# EasyEDA schematic Sheet_2.json
TITLE: Sheet_2; REV: 1.0; Date: 2025-07-21; Sheet: 1/1; Drawn By: hunarbatra1414; Company: Your Company
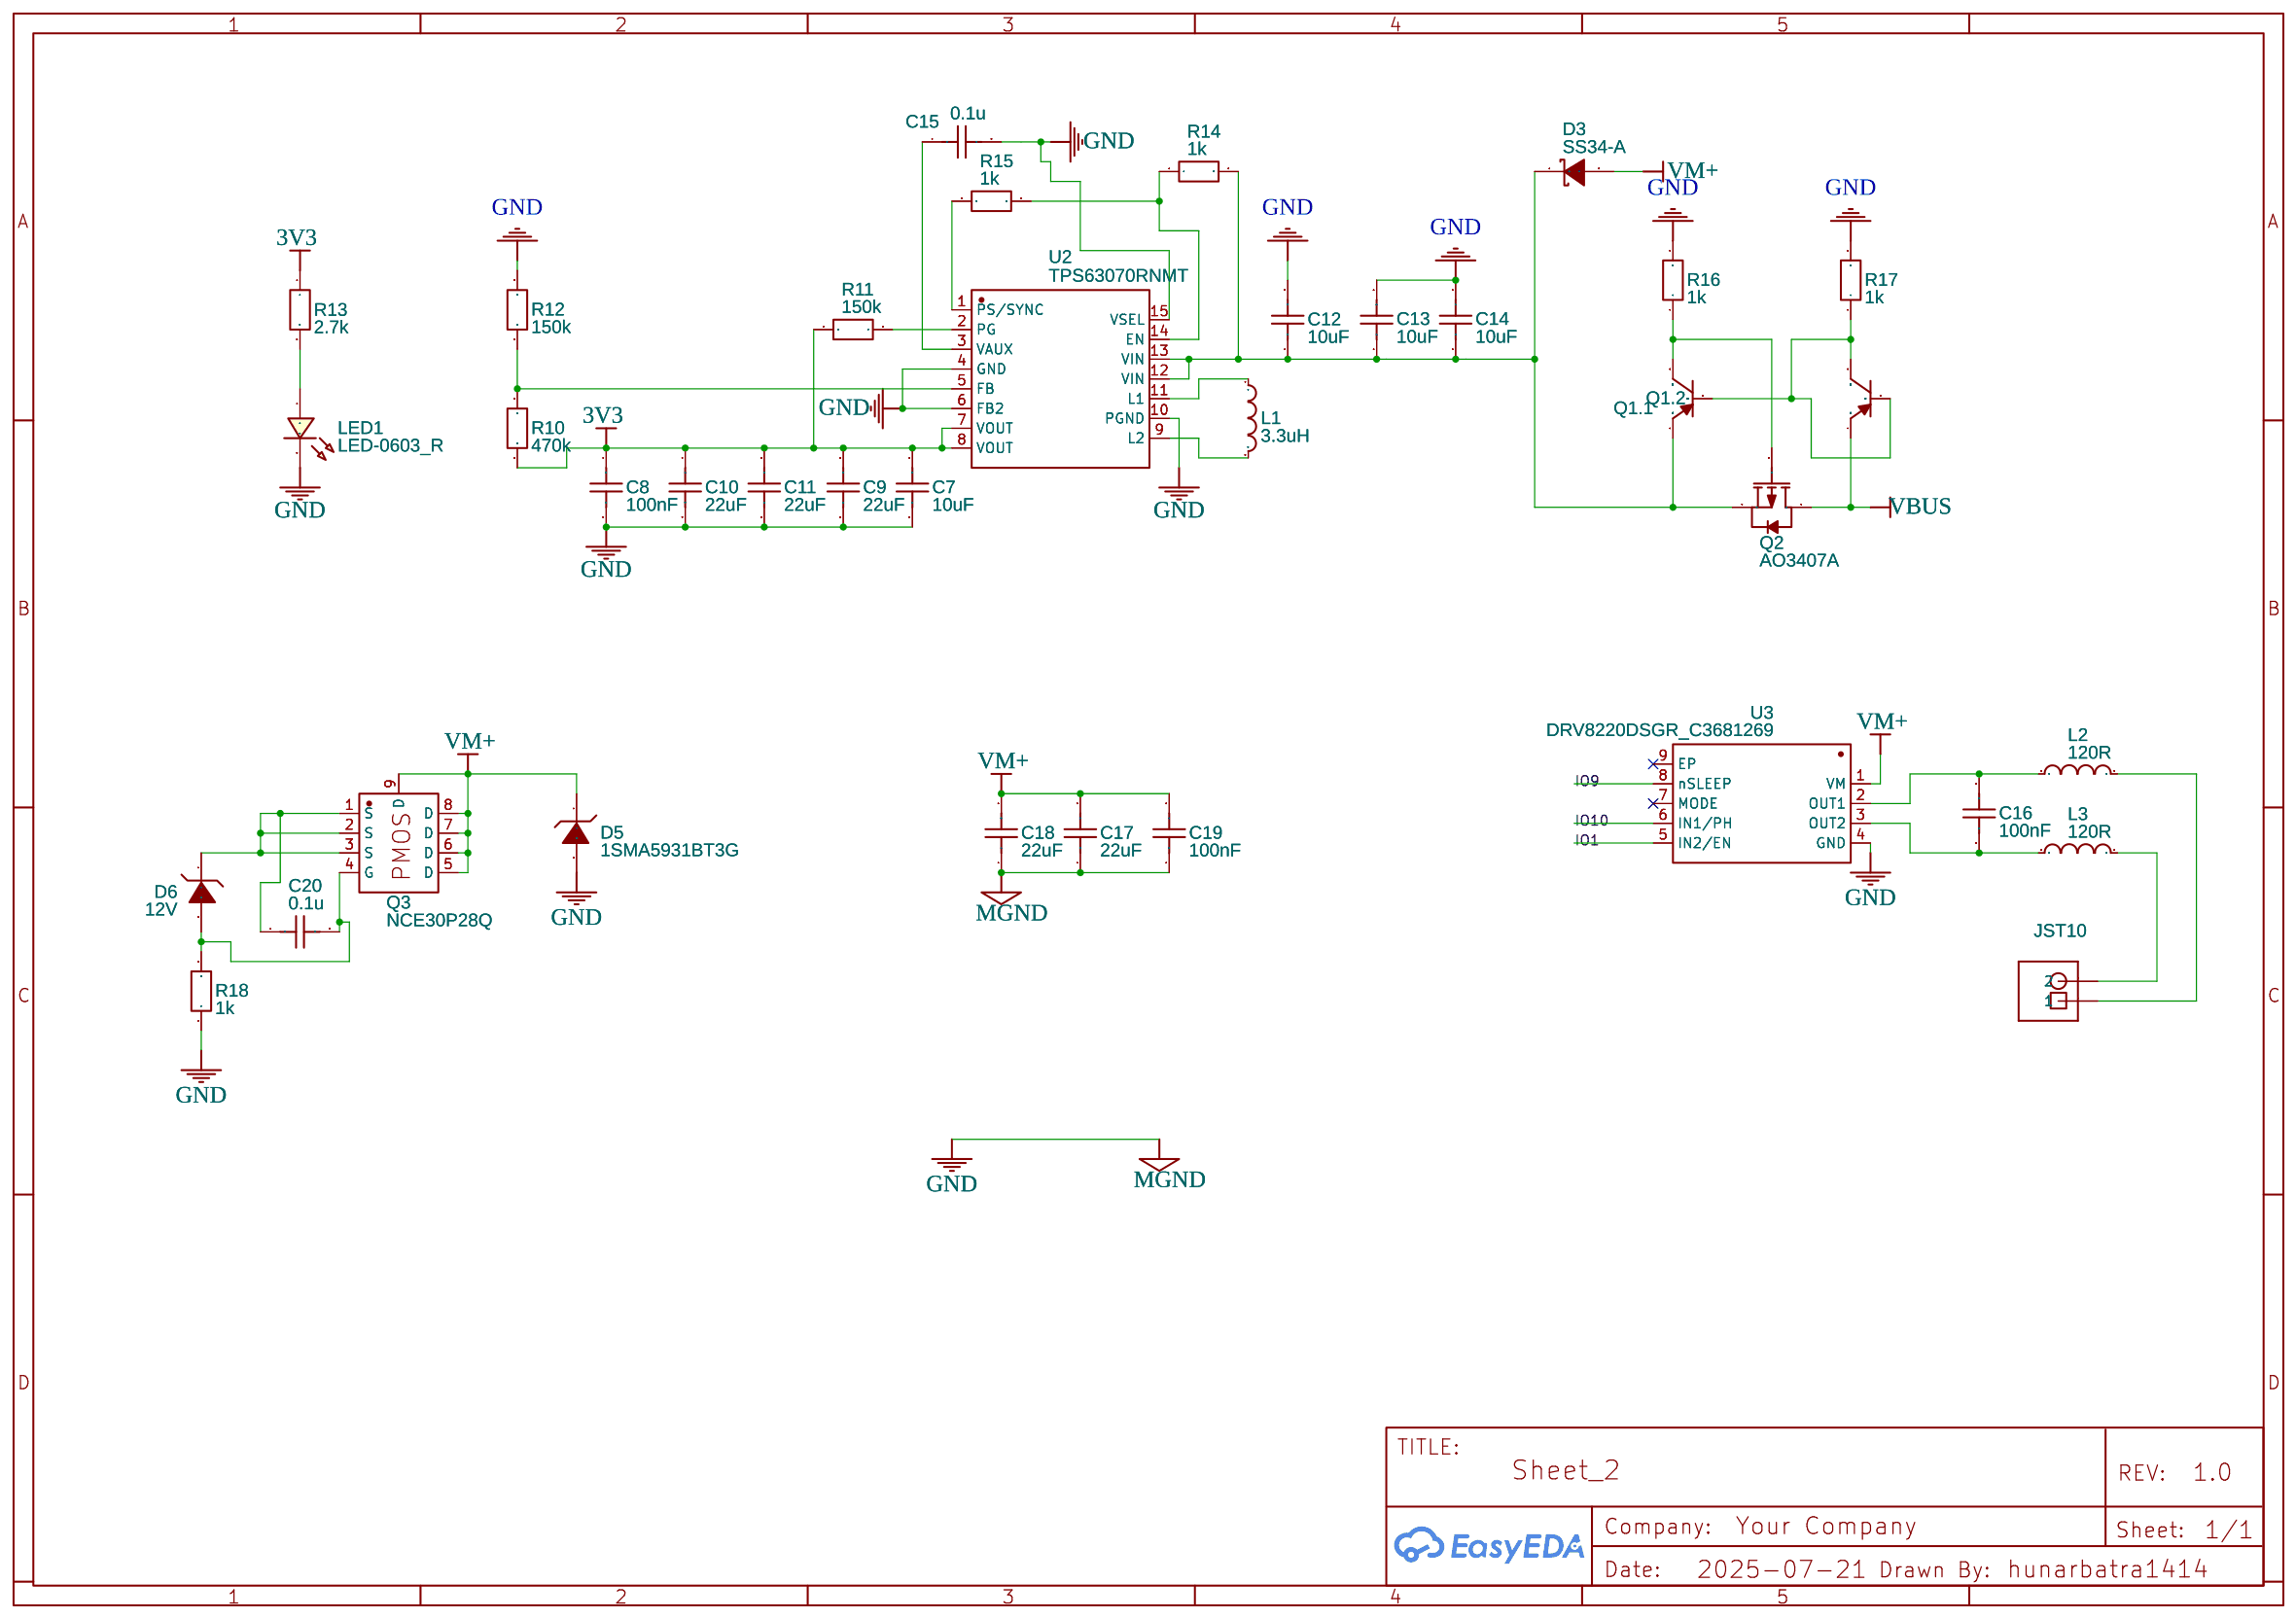
[diagram p0: schematic sheet]

## Parts
C7  10uF  [C0603]
C8  100nF  [C0603]
C9  22uF  [C0603]
C10  22uF  [C0603]
C11  22uF  [C0603]
C12  10uF  [C0603]
C13  10uF  [C0603]
C14  10uF  [C0603]
C15  0.1u  [C0603]
C16  100nF  [C0603]
C17  22uF  [C0603]
C18  22uF  [C0603]
C19  100nF  [C0603]
C20  0.1u  [C0603]
D3  SS34-A  [SMA_L4.3-W2.6-LS5.2-RD]
D5  1SMA5931BT3G  [SMA_L4.3-W2.6-LS5.2-RD]
D6  12V  [SMA_L4.3-W2.6-LS5.2-RD]
JST10  JST_2-PIN_Female_Connector  [JST_XH_2_PIN_TOP_ENTRY]
L1  3.3uH  [L0603]
L2  120R  [L0603]
L3  120R  [L0603]
LED1  LED-0603_R  [LED0603_RED]
Q1  BCM857BS_C47435898  [SOT-363_L2.1-W1.3-P0.65-LS2.1-BL]  (sections 1,2)
Q2  AO3407A  [SOT-23-3_L2.9-W1.6-P1.90-LS2.8-BR]
Q3  NCE30P28Q  [PDFN3333-8_L3.1-W3.2-P0.65-LS3.4-BL]
R10  470k  [R0603]
R11  150k  [R0603]
R12  150k  [R0603]
R13  2.7k  [R0603]
R14  1k  [R0603]
R15  1k  [R0603]
R16  1k  [R0603]
R17  1k  [R0603]
R18  1k  [R0603]
U2  TPS63070RNMT  [VQFN-HR-15_L3.0-W2.5-P0.50-BL_TPS63070RNMR]
U3  DRV8220DSGR_C3681269  [WSON-8_L2.0-W2.0-P0.50-TL-EP]

## Library data of the parts
C7-C20 = C_0603_US: Contributor: LCEDA_Lib
D3 = SS34-A: Contributor: LCSC; Supplier: LCSC; Supplier Part: C143201; Manufacturer: FMS(美丽微); JLCPCB Part Class: Extended Part
D5 D6 = 1SMA5931BT3G: Contributor: LCSC; Supplier: LCSC; Supplier Part: C94872; Manufacturer: onsemi(安森美); JLCPCB Part Class: Extended Part
JST10 = JST_2-PIN_Female_Connector: Contributor: NavinL
L1-L3 = L0603_US: Contributor: LCEDA_Lib
LED1 = LED-0603_R: Manufacturer: EVERLIGHT(台湾亿光); Manufacturer Part: 19-217/R6C-AL1M2VY/3T; Supplier Part: C72044; Supplier: LCSC; Contributor: LCEDA_01
Q1 = BCM857BS_C47435898: Supplier: LCSC; Supplier Part: C47435898; Manufacturer: GOODWORK(固得沃克); Manufacturer Part: BCM857BS; subpart_no: 1; JLCPCB Part Class: Extended Part
Q2 = AO3407A: Supplier: LCSC; Manufacturer: AOS; Supplier Part: C15155; JLCPCB Part Class: Extended Part
Q3 = NCE30P28Q: Contributor: LCSC; Supplier: LCSC; Supplier Part: C502815; Manufacturer: NCE(无锡新洁能); JLCPCB Part Class: Extended Part
R10-R18 = R_0603_EU: Contributor: LCEDA_Lib
U2 = TPS63070RNMT: Contributor: lcsc; Supplier: LCSC; Supplier Part: C964639; Manufacturer: TI(德州仪器); JLCPCB Part Class: Extended Part
U3 = DRV8220DSGR_C3681269: Contributor: lcsc; Supplier: LCSC; Supplier Part: C3681269; Manufacturer: TI(德州仪器); Manufacturer Part: DRV8220DSGR; JLCPCB Part Class: Extended Part

## Nets
3V3: C7.1 C8.1 C9.1 C10.1 C11.1 R10.2 R11.1 R13.1 U2.7(VOUT) U2.8(VOUT)
GND: C7.2 C8.2 C9.2 C10.2 C11.2 C12.2 C13.2 C14.2 C15.2 C17.1 C18.1 C19.1 D5.2(A) LED1.2 R12.2 R16.2 R17.2 R18.1 U2.4(GND) U2.6(FB2) U2.10(PGND) U2.15(VSEL) U3.4(GND)
VBUS: Q1.4(Emitter) Q2.3(D)
IO1: U3.5(IN2/EN)
IO9: U3.8(nSLEEP)
IO10: U3.6(IN1/PH)
VM+: C17.2 C18.2 C19.2 D3.2(A) D5.1(K) Q3.5(D) Q3.6(D) Q3.7(D) Q3.8(D) Q3.9(D) U3.1(VM)
Net-(C12-1): C12.1 C13.1 C14.1 D3.1(C) Q1.1(Emitter) Q2.2(S) R14.2 U2.12(VIN) U2.13(VIN)
Net-(C15-1): C15.1 U2.3(VAUX)
Net-(C16-1): C16.1 L2.1 U3.2(OUT1)
Net-(C16-2): C16.2 L3.1 U3.3(OUT2)
Net-(C20-1): C20.1 D6.1(K) Q3.1(S) Q3.2(S) Q3.3(S)
Net-(C20-2): C20.2 D6.2(A) Q3.4(G) R18.2
Net-(JST10-1): JST10.1 L2.2
Net-(JST10-2): JST10.2 L3.2
Net-(L1-1): L1.1 U2.11(L1)
Net-(L1-2): L1.2 U2.9(L2)
Net-(LED1-1): LED1.1 R13.2
Net-(Q1.1-2): Q1.2(Base) Q1.3(Collector) Q1.5(Base) R17.1
Net-(Q1.1-6): Q1.6(Collector) Q2.1(G) R16.1
Net-(R10-1): R10.1 R12.1 U2.5(FB)
Net-(R11-2): R11.2 U2.2(PG)
Net-(R14-1): R14.1 R15.2 U2.14(EN)
Net-(R15-1): R15.1 U2.1(PS/SYNC)

Not connected (* = marked no-connect by the designer): U3 7(MODE)* 9(EP)*
